# Altium schematic sheet CTR-Upper-Main-Board-Rev-B.SchDoc: ZoZbot Upper Main Board
size B; Author: RMG; Organization: OLogic, Inc.; DocumentNumber: UMB1; Revision: B; SheetNumber: 1; SheetTotal: 2; PageSetup: Record=PageOptions|CenterHorizontal=True|CenterVertical=True|PrintScale=0.70|XCorrection=1.00|YCorrection=1.00|PrintKind=0|BorderSize=5000000|LeftOffset=0|BottomOffset=0|Orientation=2|PaperLength=1000|PaperWidth=1000|Scale=100|PaperSource=15|PrintQuality=600|MediaType=1|DitherType=10|PrintScaleMode=1|PaperKind=Letter|PaperIndex=1
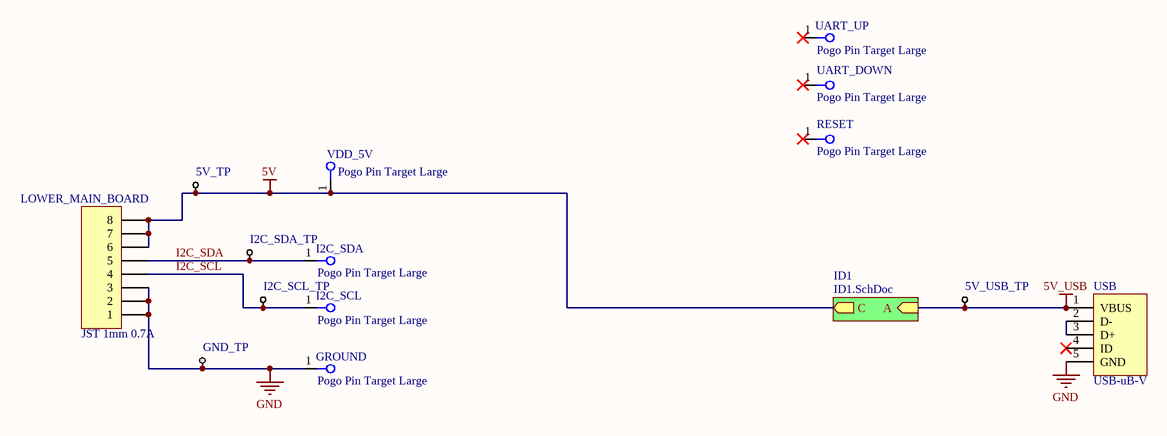
[diagram p0: CTR-Upper-Main-Board-Rev-B.SchDoc]

## Parts
5V_TP  Test Point  [TestPoint-TH 42 mil]  (value not drawn)  (no BOM)
5V_USB_TP  Test Point  [TestPoint-TH 42 mil]  (value not drawn)  (no BOM)
GND_TP  Test Point  [TestPoint-TH 42 mil]  (value not drawn)  (no BOM)
GROUND  Pogo Pin Target Large  [CTR_POGO_PIN_TARGET_LARGE]
I2C_SCL  Pogo Pin Target Large  [CTR_POGO_PIN_TARGET_LARGE]
I2C_SCL_TP  Test Point  [TestPoint-TH 42 mil]  (value not drawn)  (no BOM)
I2C_SDA  Pogo Pin Target Large  [CTR_POGO_PIN_TARGET_LARGE]
I2C_SDA_TP  Test Point  [TestPoint-TH 42 mil]  (value not drawn)  (no BOM)
LOWER_MAIN_BOARD  JST 1mm 0.7A  [JST-BM08B-SRSS-TB]
RESET  Pogo Pin Target Large  [CTR_POGO_PIN_TARGET_LARGE]
UART_DOWN  Pogo Pin Target Large  [CTR_POGO_PIN_TARGET_LARGE]
UART_UP  Pogo Pin Target Large  [CTR_POGO_PIN_TARGET_LARGE]
USB  USB-uB-V  [MOLEX_105133-0011]
VDD_5V  Pogo Pin Target Large  [CTR_POGO_PIN_TARGET_LARGE]

## Sub-sheets
ID1 = ID1.SchDoc: A (in), C (out)

## Nets
5V: 5V_TP.1 LOWER_MAIN_BOARD.6 LOWER_MAIN_BOARD.7 LOWER_MAIN_BOARD.8 VDD_5V.1(A) ; sheet ID1/C
5V_USB: 5V_USB_TP.1 USB.1(VBUS) ; sheet ID1/A
GND: GND_TP.1 GROUND.1(A) LOWER_MAIN_BOARD.0 LOWER_MAIN_BOARD.1 LOWER_MAIN_BOARD.2 LOWER_MAIN_BOARD.3 USB.0 USB.5(GND)
I2C_SCL: I2C_SCL.1(A) I2C_SCL_TP.1 LOWER_MAIN_BOARD.4
I2C_SDA: I2C_SDA.1(A) I2C_SDA_TP.1 LOWER_MAIN_BOARD.5
NetUSB_2: USB.2(D-) USB.3(D+)

Not connected (* = marked no-connect by the designer): RESET 1(A)*; UART_DOWN 1(A)*; UART_UP 1(A)*; USB 4(ID)*

## Notes on the sheet
- Title
- By:
- Date:
- Number:
- Time:
- Revision:
- Sheet
- of
- OLogic, Inc.
- 1394 Borregas Ave.
- Sunnyvale, CA
- 94089 USA
- File:
- (650) 996-1490

## Library data of the parts
5V_TP 5V_USB_TP GND_TP I2C_SCL_TP I2C_SDA_TP = TestPoint, small
GROUND I2C_SCL I2C_SDA RESET UART_DOWN UART_UP VDD_5V = CTR Pogo Pin Target Large: Manufacturer Part Number 1: Large Target; Plating: Gold; Category: Connectors, Interconnects; Part Status: Active; Material: Copper Alloy; Mounting Type: Through Hole; Manufacturer 1: CTR; Supplier Unit Price 1: 0.15; Supplier 1: CTR; Supplier Part Number 1: Large Target; Supplier Stock 1: 9999999
LOWER_MAIN_BOARD = JST-BM08B-SRSS-TB(LF)(SN): 1mm Locking Header, 8-Pin; Manufacturer: Japan Solderless Terminals (JST); No of Positions: 8; Style/Orientation: Vertical Header/Plug; Supplier 1: Digikey; Manufacturer Part Number: BM08B-SRSS-TB(LF)(SN); Stock 1: 18919; Pricing 1: 1=0.93, 10=0.814, 100=0.7024, 500=0.5747 (USD); Pitch: 1 mm; Type: Shrouded Header; Termination: Solder; ComponentLink1URL: https://datasheet.ciiva.com/730/esr-730608.pdf; ComponentLink1Description: https://datasheet.ciiva.com/730/esr-730608.pdf; ComponentLink2URL: https://datasheet.ciiva.com/26894/getdatasheetpartid-640965-26894529.pdf; ComponentLink2Description: https://datasheet.ciiva.com/26894/getdatasheetpartid-640965-26894529.pdf; ComponentLink3URL: https://datasheet.ciiva.com/712/esr-712616.pdf; ComponentLink3Description: https://datasheet.ciiva.com/712/esr-712616.pdf; ComponentLink4URL: https://datasheet.ciiva.com/712/esr-712617.pdf; ComponentLink4Description: https://datasheet.ciiva.com/712/esr-712617.pdf; ComponentLink5URL: https://datasheet.ciiva.com/8052/91630-8052091.pdf; ComponentLink5Description: https://datasheet.ciiva.com/8052/91630-8052091.pdf; ComponentLink6URL: https://datasheet.ciiva.com/16380/esr-16380526.pdf; ComponentLink6Description: https://datasheet.ciiva.com/16380/esr-16380526.pdf; Supplier Part Number 1: 455-1794-1-ND
USB = USB-MicroB-V: USB, Micro-B, Vertical; Manufacturer: Molex, LLC; Manufacturer Part Number: 1051330001; Number of Contacts: 5; Gender: Receptacle; Specifications: USB 2.0; Number of Ports: 1; Current Rating: 1A, 1.8A; Voltage - Rated: 30VAC; Mating Cycles: 10000; Shielding: Shielded; Material Flammability Rating: UL94 V-0; Supplier 1: Digi-Key; RoHS: RoHS Compliant; Category: Connectors, Interconnects; Stock 1: 35948; Pricing 1: 1=1.06, 10=0.928, 25=0.8732, 50=0.837, 100=0.8005, 250=0.72776 (USD); Packaging: Cut Tape (CT); Part Status: Active; Connector Type: USB - micro B; Mounting Type: Surface Mount; Mounting Feature: Vertical; Termination: Solder; Features: Pick and Place; Ingress Protection: -; Operating Temperature: -35°C ~ 85°C; Contact Finish: Gold; Shell/Shielding Material: Steel, Stainless; Insulation Color: Black; ComponentLink1URL: http://www.molex.com/pdm_docs/sd/1051330001_sd.pdf; ComponentLink1Description: http://www.molex.com/pdm_docs/sd/1051330001_sd.pdf; Supplier Part Number 1: WM9734CT-ND